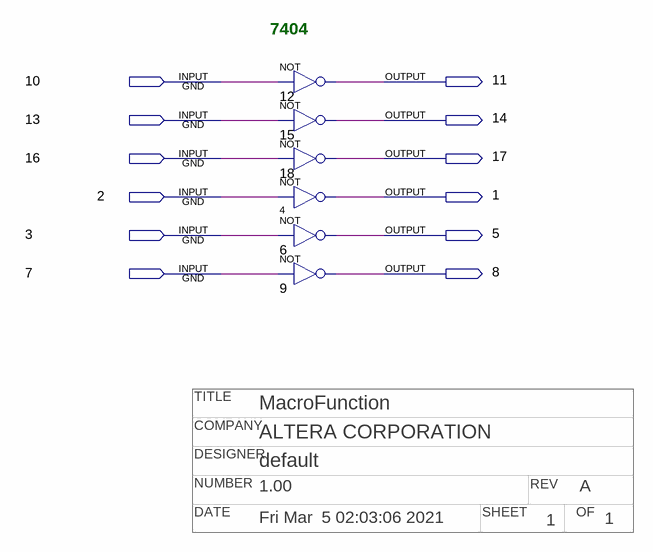
[diagram p0: schematic sheet]
// Quartus schematic inverter.bdf as structural Verilog: 6 symbols, 12 pins
// Title block: TITLE: MacroFunction; COMPANY: ALTERA CORPORATION; DESIGNER: default; NUMBER: 1.00; REV: A; DATE: Fri Mar  5 02:03:06 2021; SHEET: 1; OF: 1
module inverter (
  input  \10 ,
  input  \13 ,
  input  \16 ,
  input  \2 ,
  input  \3 ,
  input  \7 ,
  output \11 ,
  output \14 ,
  output \17 ,
  output \1 ,
  output \5 ,
  output \8 
);

  not u_12 (\11 , \10 );
  not u_15 (\14 , \13 );
  not u_18 (\17 , \16 );
  not u_4 (\1 , \2 );
  not u_6 (\5 , \3 );
  not u_9 (\8 , \7 );

  // Notes on the sheet:
  //   7404
endmodule
